# Altium schematic sheet H_Bridge_Mosate.SchDoc
size A4; Organization: Altium Limited; Address1: L3, 12a Rodborough Rd; Address2: Frenchs Forest; Address3: NSW; Address4: Australia 2086
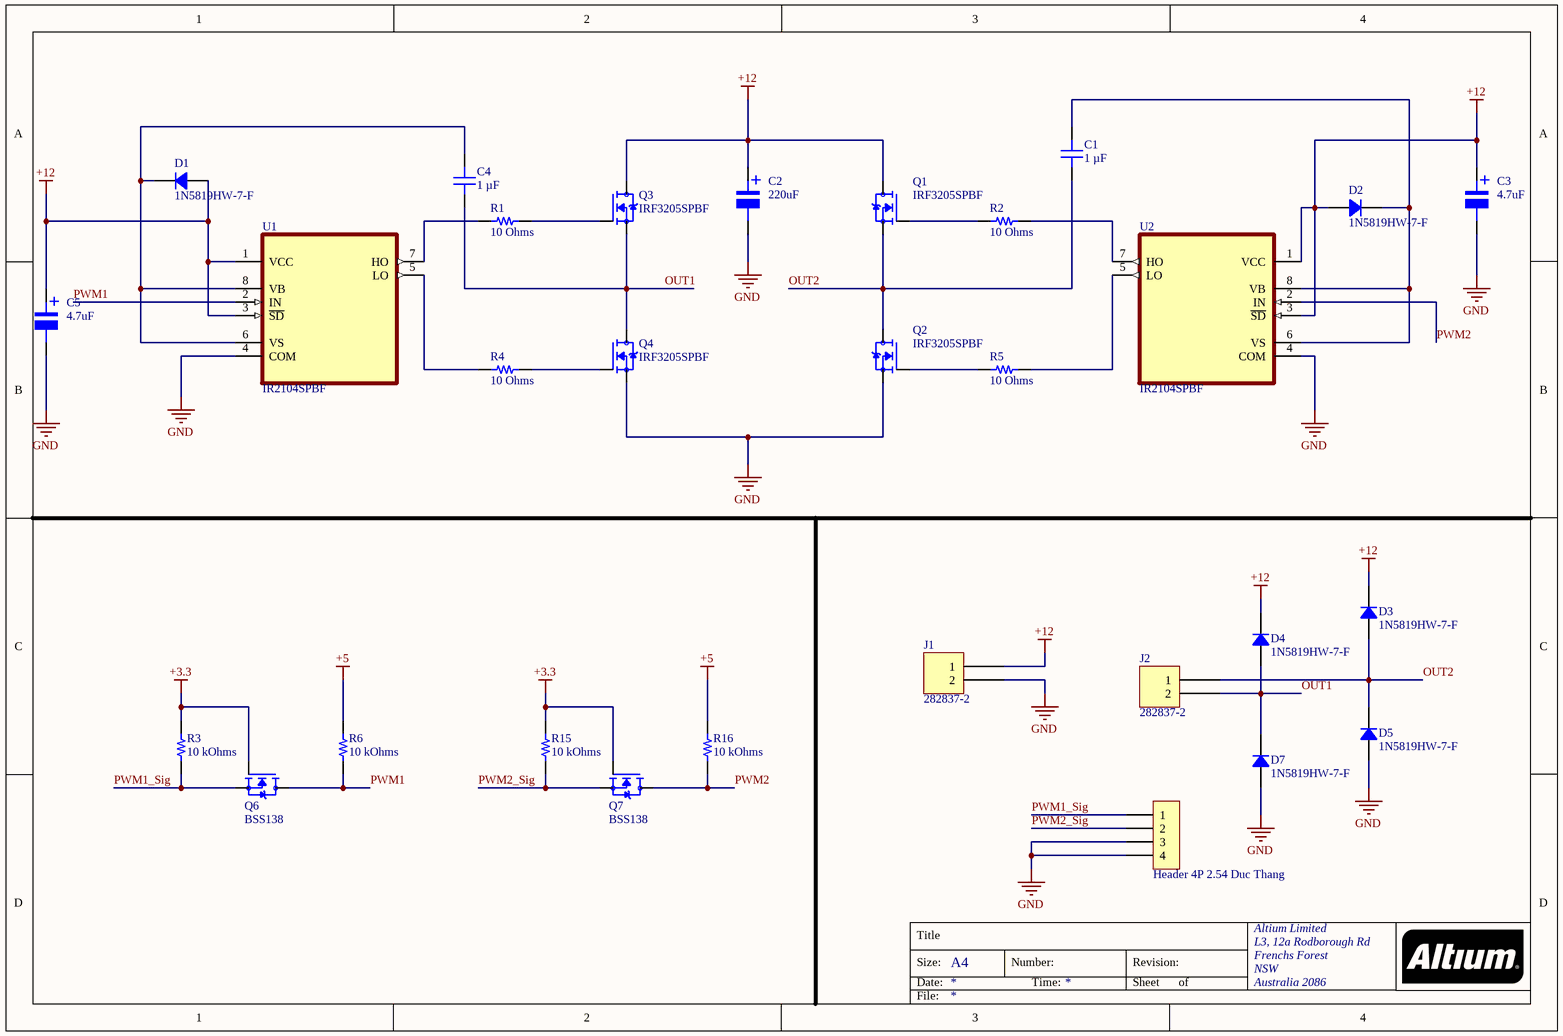
[diagram p0: H_Bridge_Mosate.SchDoc]

## Parts
C1  1 µF  [CAP 0603_1608]
C2  220uF  [tu nhom 8 (f)]
C3  4.7uF  [tu nhom 4 (b)]
C4  1 µF  [CAP 0603_1608]
C5  4.7uF  [tu nhom 4 (b)]
D1  1N5819HW-7-F  [SOD-123]
D2  1N5819HW-7-F  [SOD-123]
D3  1N5819HW-7-F  [SOD-123]
D4  1N5819HW-7-F  [SOD-123]
D5  1N5819HW-7-F  [SOD-123]
D7  1N5819HW-7-F  [SOD-123]
H1  Header 4P 2.54 Duc Thang  [XH2.54M-4]
J1  282837-2  [TE 282837-2]
J2  282837-2  [TE 282837-2]
Q1  IRF3205SPBF  [TRANS_IRF3205SPBF]
Q2  IRF3205SPBF  [TRANS_IRF3205SPBF]
Q3  IRF3205SPBF  [TRANS_IRF3205SPBF]
Q4  IRF3205SPBF  [TRANS_IRF3205SPBF]
Q6  BSS138  [SOT95P240X111-3N]
Q7  BSS138  [SOT95P240X111-3N]
R1  10 Ohms  [RES 0603_1608]
R2  10 Ohms  [RES 0603_1608]
R3  10 kOhms  [RES 0603_1608]
R4  10 Ohms  [RES 0603_1608]
R5  10 Ohms  [RES 0603_1608]
R6  10 kOhms  [RES 0603_1608]
R15  10 kOhms  [RES 0603_1608]
R16  10 kOhms  [RES 0603_1608]
U1  IR2104SPBF  [SOIC127P600X175-8N]
U2  IR2104SPBF  [SOIC127P600X175-8N]

## Nets
+3.3: Q6.1(G) Q7.1(G) R3.2 R15.2
+5: R6.2 R16.2
+12: C2.1 C3.1 C5.1 D1.1 D2.1 D3.2 D4.2 J1.1 Q1.2(D) Q3.2(D) U1.1(VCC) U1.3(~{SD}) U2.1(VCC) U2.3(~{SD})
GND: C2.2 C3.2 C5.2 D5.1 D7.1 H1.3 H1.4 J1.2 Q2.3(S) Q4.3(S) U1.4(COM) U2.4(COM)
OUT1: C4.1 D4.1 D7.2 J2.2 Q3.3(S) Q4.2(D)
OUT2: C1.1 D3.1 D5.2 J2.1 Q1.3(S) Q2.2(D)
PWM1: Q6.3(D) R6.1 U1.2(IN)
PWM1_Sig: H1.1 Q6.2(S) R3.1
PWM2: Q7.3(D) R16.1 U2.2(IN)
PWM2_Sig: H1.2 Q7.2(S) R15.1
NetC1_2: C1.2 D2.2 U2.6(VS) U2.8(VB)
NetC4_2: C4.2 D1.2 U1.6(VS) U1.8(VB)
NetQ1_1: Q1.1(G) R2.1
NetQ2_1: Q2.1(G) R5.1
NetQ3_1: Q3.1(G) R1.2
NetQ4_1: Q4.1(G) R4.2
NetR1_1: R1.1 U1.7(HO)
NetR2_2: R2.2 U2.7(HO)
NetR4_1: R4.1 U1.5(LO)
NetR5_2: R5.2 U2.5(LO)

## Notes on the sheet
- Title
- Size:
- Date:
- A4
- Number:
- Time:
- Revision:
- Sheet
- of
- File:
- (in symbol Tu Nhom 4.7uF 25V) +
- (in symbol Tu Nhom 220uF 25V) +

## Library data of the parts
C1 C4 = GCG188L8EE105KA07D: CAP CER 1UF 16V X8L 0603; manufacturer: Murata Electronics; Tolerance: ±10%; Part Number: GCG188L8EE105KA07D; Value: 1 µF; Applications: Automotive; Capacitance: 1 µF; componentlink2description: DigiKey Link; componentlink2url: https://www.digikey.com/en/products/detail/murata-electronics/GCG188L8EE105KA07D/10695125; Device Package: 0603 (1608 Metric); Features: Epoxy Mountable; lastupdated: 2/9/2024 8:09:54 PM; Lifecycle Status: Active; Minimum Order: 1; Mounting Type: Surface Mount, MLCC; Operating Temperature: -55°C ~ 150°C; Package / Case: 0603 (1608 Metric); packaging: TapeAndReel; partid: 46174; Part Status: Active; price: 0.04; Ratings: AEC-Q200; series: GCG; Size / Dimension: 0.063" L x 0.031" W (1.60mm x 0.80mm); Supplier 1: DigiKey; Supplier Part Number 1: 490-GCG188L8EE105KA07DCT-ND; Temperature Coefficient: X8L; Thickness (Max): 0.035" (0.90mm); Voltage - Rated: 16V
C2 = Tu Nhom 220uF 25V: Dán; Don_Vi: Con; So_Chan: 2; Ten_Linh_Kien: Tụ Nhôm 220uF 25V; Ma_Hang: MH002221; Chung_Loai: Dán; Kieu_Chan: *
C3 C5 = Tu Nhom 4.7uF 25V: Dán; Don_Vi: Con; So_Chan: 2; Ten_Linh_Kien: Tụ Nhôm 4.7uF 25V 4x4.5MM; Ma_Hang: MH003790; Chung_Loai: Dán; Kieu_Chan: *
D1-D5 D7 = 1N5819HW-7-F: DIODE SCHOTTKY 40V 1A SOD123; Manufacturer: Diodes Incorporated; Capacitance @ Vr, F: 60pF @ 4V, 1MHz; Current - Reverse Leakage @ Vr: 1 mA @ 40 V; Speed: Fast Recovery =< 500ns, > 200mA (Io); Voltage - Forward (Vf) (Max) @ If: 450 mV @ 1 A; Part Number: 1N5819HW-7-F; ComponentLink1Description: Datasheet; ComponentLink1URL: https://www.diodes.com/assets/Datasheets/ds30217.pdf; ComponentLink2Description: DigiKey Link; ComponentLink2URL: https://www.digikey.com/en/products/detail/diodes-incorporated/1N5819HW-7-F/814970; Current - Average Rectified (Io): 1A; Diode Type: Schottky; LastUpdated: 6/3/2024 7:54:46 PM; Lifecycle Status: Active; Minimum Order: 1; Mounting Type: Surface Mount; Operating Temperature - Junction: -65°C ~ 125°C; Package / Case: SOD-123; Packaging: TapeAndReel; PartId: 2212; Part Status: Active; Price: 0.05; Series: -; Supplier 1: DigiKey; Supplier Part Number 1: 1N5819HW-FDICT-ND; Supplier Device Package: SOD-123; Voltage - DC Reverse (Vr) (Max): 40 V
H1 = Header 4P 2.54 Duc Thang: Cắm; Ten_Linh_Kien: Header 4P XH2.54-4P Đực Thẳng; Don_Vi: Con; Ma_Hang: MH001285; Chung_Loai: Cắm
J1 J2 = 282837-2: TERM BLK 2P SIDE ENT 5.08MM PCB; Manufacturer: TE Connectivity AMP Connectors; Current: 13.5 A; Mating Orientation: Horizontal with Board; Number of Levels: 1; Pitch: 0.200" (5.08mm); Positions Per Level: 2; Voltage: 300 V; Wire Gauge: 16-28 AWG; Wire Termination: Screw - Rising Cage Clamp; Part Number: 282837-2; Color: Green; ComponentLink1Description: Datasheet; ComponentLink1URL: https://www.te.com/commerce/DocumentDelivery/DDEController?Action=srchrtrv&DocNm=282837&DocType=Customer+Drawing&DocLang=English; ComponentLink2Description: DigiKey Link; ComponentLink2URL: https://www.digikey.com/en/products/detail/te-connectivity-amp-connectors/282837-2/2187973; Features: Interlocking (Side); LastUpdated: 6/21/2022 3:00:23 PM; Lifecycle Status: Active; Minimum Order: 1; Mounting Type: Through Hole; Packaging: Tray; Part Status: Active; Price: 0.31; Series: Buchanan; Supplier 1: DigiKey; Supplier Part Number 1: A113320-ND
Q1-Q4 = IRF3205SPBF: RoHS Compliant | Low RDS_on_ | Industry-leading quality | Dynamic dv/dt Rating | Fast Switching | Fully Avalanche Rated | 175C Operating Temperature; MF: Infineon Technologies; Package: D2PAK Infineon; Price: None; SnapEDA_Link: https://www.snapeda.com/parts/IRF3205SPBF/Infineon%20Technologies/view-part/576468/?ref=snap; Availability: Unavailable; Value: *; MP: IRF3205SPBF
Q6 Q7 = BSS138: N-Channel 50 V 220mA (Ta) 350mW (Ta) Surface Mount SOT-23-3; MF: onsemi; SnapEDA_Link: https://www.snapeda.com/parts/BSS138/Onsemi/view-part/?ref=snap; Package: SOT-23-3 Motorola; Value: *; MP: BSS138; Check_prices: https://www.snapeda.com/parts/BSS138/Onsemi/view-part/?ref=eda
R1 R2 R4 R5 = ERJ-UP3F10R0V: RES 10 OHM 1% 1/4W 0603; Manufacturer: Panasonic Electronic Components; Power (Watts): 0.25W, 1/4W; Temperature Coefficient: ±100ppm/°C; Part Number: ERJ-UP3F10R0V; Value: 10 Ohms; ComponentLink1Description: Datasheet; ComponentLink1URL: https://b2b-api.panasonic.eu/file_stream/pids/fileversion/4484; ComponentLink2Description: DigiKey Link; ComponentLink2URL: https://www.digikey.com/en/products/detail/panasonic-electronic-components/ERJ-UP3F10R0V/12092098; Composition: Thick Film; Device Package: 0603 (1608 Metric); Features: Anti-Sulfur, Automotive AEC-Q200, Pulse Withstanding; Height - Seated (Max): 0.022" (0.55mm); LastUpdated: 2/9/2024 8:41:13 PM; Lifecycle Status: Active; Minimum Order: 1; Number of Terminations: 2; Operating Temperature: -55°C ~ 155°C; Package / Case: 0603 (1608 Metric); Packaging: TapeAndReel; PartId: 66744; Part Status: Active; Price: 0.02; Ratings: AEC-Q200; Resistance: 10 Ohms; Series: ERJ-UP3; Size / Dimension: 0.063" L x 0.031" W (1.60mm x 0.80mm); Supplier 1: DigiKey; Supplier Part Number 1: 10-ERJ-UP3F10R0VCT-ND; Supplier Device Package: 0603; Tolerance: ±1%
R3 R6 R15 R16 = AC0603FR-0710KL: RES SMD 10K OHM 1% 1/10W 0603; Manufacturer: Yageo; Power (Watts): 0.1W, 1/10W; Temperature Coefficient: ±100ppm/°C; Part Number: AC0603FR-0710KL; Value: 10 kOhms; ComponentLink1Description: Datasheet; ComponentLink1URL: https://www.yageo.com/upload/media/product/productsearch/datasheet/rchip/PYu-AC_51_RoHS_L_7.pdf; ComponentLink2Description: DigiKey Link; ComponentLink2URL: https://www.digikey.com/en/products/detail/yageo/AC0603FR-0710KL/2827814; Composition: Thick Film; Device Package: 0603 (1608 Metric); Features: Automotive AEC-Q200, Moisture Resistant; Height - Seated (Max): 0.022" (0.55mm); LastUpdated: 2/9/2024 8:42:48 PM; Lifecycle Status: Active; Minimum Order: 1; Number of Terminations: 2; Operating Temperature: -55°C ~ 155°C; Package / Case: 0603 (1608 Metric); Packaging: CutTape; PartId: 17347; Part Status: Active; Price: 0.01; Ratings: AEC-Q200; Resistance: 10 kOhms; Series: AC; Size / Dimension: 0.063" L x 0.031" W (1.60mm x 0.80mm); Supplier 1: DigiKey; Supplier Part Number 1: 311-10KLDCT-ND; Supplier Device Package: 0603; Tolerance: ±1%
U1 U2 = IR2104SPBF: Floating channel designed for bootstrap operation | Fully operational to +600 V | Tolerant to negative transient voltage | dV/dt immune | Gate drive supply range from 10 to 20 V | Undervoltage lockout | 3.3 V, 5 V, and 15 V logic input compatible | Cross-conduction prevention logic | Matched propagation delay for both channels | Internal set deadtime | High side output in phase with HIN input | Shut down input turns off both channels; MF: Infineon; Purchase-URL: https://pricing.snapeda.com/search/part/IR2104SPBF/?ref=eda; MP: IR2104SPBF; SnapEDA_Link: https://www.snapeda.com/parts/IR2104SPBF/Infineon%20Technologies/view-part/61964/?ref=snap; Price: None; Package: SOIC-8 International Rectifier; Value: *; Availability: Warning; Check_prices: https://www.snapeda.com/parts/IR2104SPBF/Infineon%20Technologies/view-part/61964/?ref=eda